# EAGLE schematic icarus-rev01 (EAGLE 7.5.0)
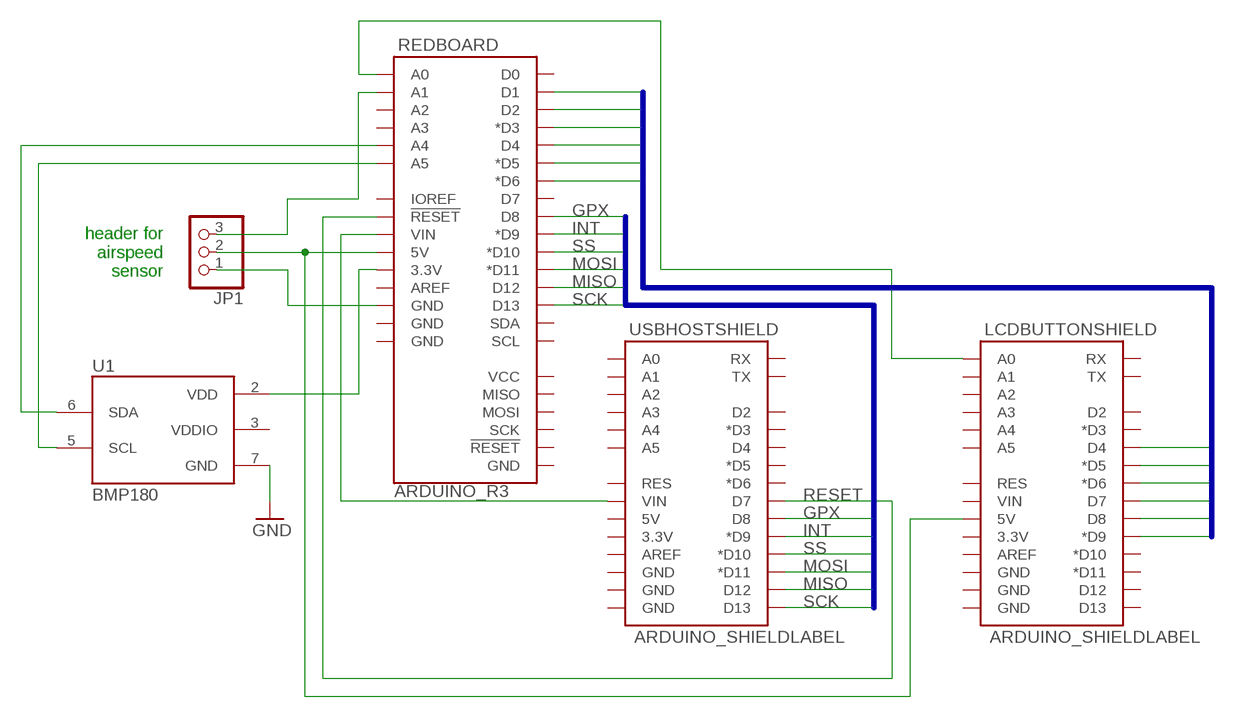
[diagram p0: schematic, sheet 1]

## Parts
JP1  PINHD-1X3/90  [1X03/90]
LCDBUTTONSHIELD  ARDUINO_SHIELDLABEL  [DUEMILANOVE_SHIELD]
REDBOARD  ARDUINO_R3  [ARDUINO_R3]
U1  BMP180  [BMP180]
USBHOSTSHIELD  ARDUINO_SHIELDLABEL  [DUEMILANOVE_SHIELD]

## Nets
D0: LCDBUTTONSHIELD.D4 REDBOARD.D4
D1: LCDBUTTONSHIELD.D5(*D5) REDBOARD.D5(*D5)
D2: LCDBUTTONSHIELD.D6(*D6) REDBOARD.D6(*D6)
D3: LCDBUTTONSHIELD.D7 REDBOARD.D3(*D3)
D4: LCDBUTTONSHIELD.D8 REDBOARD.D2
D5: LCDBUTTONSHIELD.D9(*D9)
GND: U1.7(GND)
GPX: REDBOARD.D8 USBHOSTSHIELD.D8
INT: REDBOARD.D9(*D9) USBHOSTSHIELD.D9(*D9)
LCD0: REDBOARD.D1
MISO: REDBOARD.D12 USBHOSTSHIELD.D12
MOSI: REDBOARD.D11(*D11) USBHOSTSHIELD.D11(*D11)
N$1: LCDBUTTONSHIELD.A0 REDBOARD.A0
N$2: REDBOARD.VIN USBHOSTSHIELD.VIN
N$3: JP1.2 LCDBUTTONSHIELD.5V REDBOARD.5V
N$4: REDBOARD.3.3V U1.2(VDD)
N$5: JP1.1 REDBOARD.GND@4(GND)
N$6: JP1.3 REDBOARD.A1
RESET: REDBOARD.RESET@1(!RESET!) USBHOSTSHIELD.D7
SCK: REDBOARD.D13 USBHOSTSHIELD.D13
SCL: REDBOARD.A5 U1.5(SCL)
SDA: REDBOARD.A4 U1.6(SDA)
SS: REDBOARD.D10(*D10) USBHOSTSHIELD.D10(*D10)
Unconnected: LCDBUTTONSHIELD.3.3V LCDBUTTONSHIELD.A1 LCDBUTTONSHIELD.A2 LCDBUTTONSHIELD.A3 LCDBUTTONSHIELD.A4 LCDBUTTONSHIELD.A5 LCDBUTTONSHIELD.AREF LCDBUTTONSHIELD.D2 LCDBUTTONSHIELD.D3(*D3) LCDBUTTONSHIELD.D10(*D10) LCDBUTTONSHIELD.D11(*D11) LCDBUTTONSHIELD.D12 LCDBUTTONSHIELD.D13 LCDBUTTONSHIELD.GND@0(GND) LCDBUTTONSHIELD.GND@1(GND) LCDBUTTONSHIELD.GND@2(GND) LCDBUTTONSHIELD.RES LCDBUTTONSHIELD.RX LCDBUTTONSHIELD.TX LCDBUTTONSHIELD.VIN REDBOARD.A2 REDBOARD.A3 REDBOARD.AREF REDBOARD.D0 REDBOARD.D7 REDBOARD.GND@1(GND) REDBOARD.GND@2(GND) REDBOARD.GND@3(GND) REDBOARD.IOREF REDBOARD.MISO REDBOARD.MOSI REDBOARD.RESET@2(!RESET!) REDBOARD.SCK REDBOARD.SCL REDBOARD.SDA REDBOARD.VCC USBHOSTSHIELD.3.3V USBHOSTSHIELD.5V USBHOSTSHIELD.A0 USBHOSTSHIELD.A1 USBHOSTSHIELD.A2 USBHOSTSHIELD.A3 USBHOSTSHIELD.A4 USBHOSTSHIELD.A5 USBHOSTSHIELD.AREF USBHOSTSHIELD.D2 USBHOSTSHIELD.D3(*D3) USBHOSTSHIELD.D4 USBHOSTSHIELD.D5(*D5) USBHOSTSHIELD.D6(*D6) USBHOSTSHIELD.GND@0(GND) USBHOSTSHIELD.GND@1(GND) USBHOSTSHIELD.GND@2(GND) USBHOSTSHIELD.RES USBHOSTSHIELD.RX USBHOSTSHIELD.TX

## Buses
LCD[0..5]
GPX,INT,SS,MOSI,MISO,SCK

## Notes on the sheet
- header for
  airspeed
  sensor

## Power pins joined to a net without a drawn wire
VDDIO: U1.3(VDDIO)

## Library data of the parts
JP1 = pinhead:PINHD-1X3: PIN HEADER
LCDBUTTONSHIELD USBHOSTSHIELD = SparkFun-Boards:ARDUINO_SHIELD: Arduino shield footprint
REDBOARD = SparkFun-Boards:ARDUINO_R3: Arduino R3 Footprint (w/ SPI header)
U1 = SparkFun-Sensors:BMP180: BOSCH BMP180 DIGITAL BAROMETRIC PRESSURE SENSOR Web page: http://www.bosch-sensortec.com/en/homepage/products_3/environmental_sensors_1/bmp180_1/bmp180 Datasheet: http://ae-bst.resource.bosch.com/media/products/dokumente/bmp180/BST-BMP180-DS000-09.pdf The BMP180 is the function compatible successor of the BMP085, a new generation of high precision digital pressure sensors for consumer applications. The ultra-low power, low voltage electronics of the BMP180 is optimized for use in mobile phones, PDAs, GPS navigation devices and outdoor equipment. With a low altitude noise of merely 0.25m at fast conversion time, the BMP180 offers superior performance. The I2C interface allows for easy system integration with a microcontroller. The BMP180 is based on piezo-resistive technology for EMC robustness, high accuracy and linearity as well as long term stability. Key features: - Temperature measurement included - I2C interface - Fully calibrated - Pb-free, halogen-free and RoHS compliant, - MSL 1 Basic specs: Pressure range: 300 to 1100hPa (+9000m to -500m relating to sea level) Supply voltage: 1.8 to 3.6V (VDD), 1.62V to 3.6V (VDDIO) Package: LGA package with metal lid Small footprint: 3.6mm x 3.8mm Super-flat: 0.93mm height Low power: 5μA at 1 sample / sec. in standard mode Low noise: 0.06hPa (0.5m) in ultra low power mode, 0.02hPa (0.17m) advanced resolution mode Typical applications: - Enhancement of GPS navigation (dead-reckoning, slope detection, etc.) - In- and out-door navigation - Leisure and sports - Weather forecast - Vertical velocity indication (rise/sink speed)